# Altium project 23.WatchX_Test2.PrjPcb
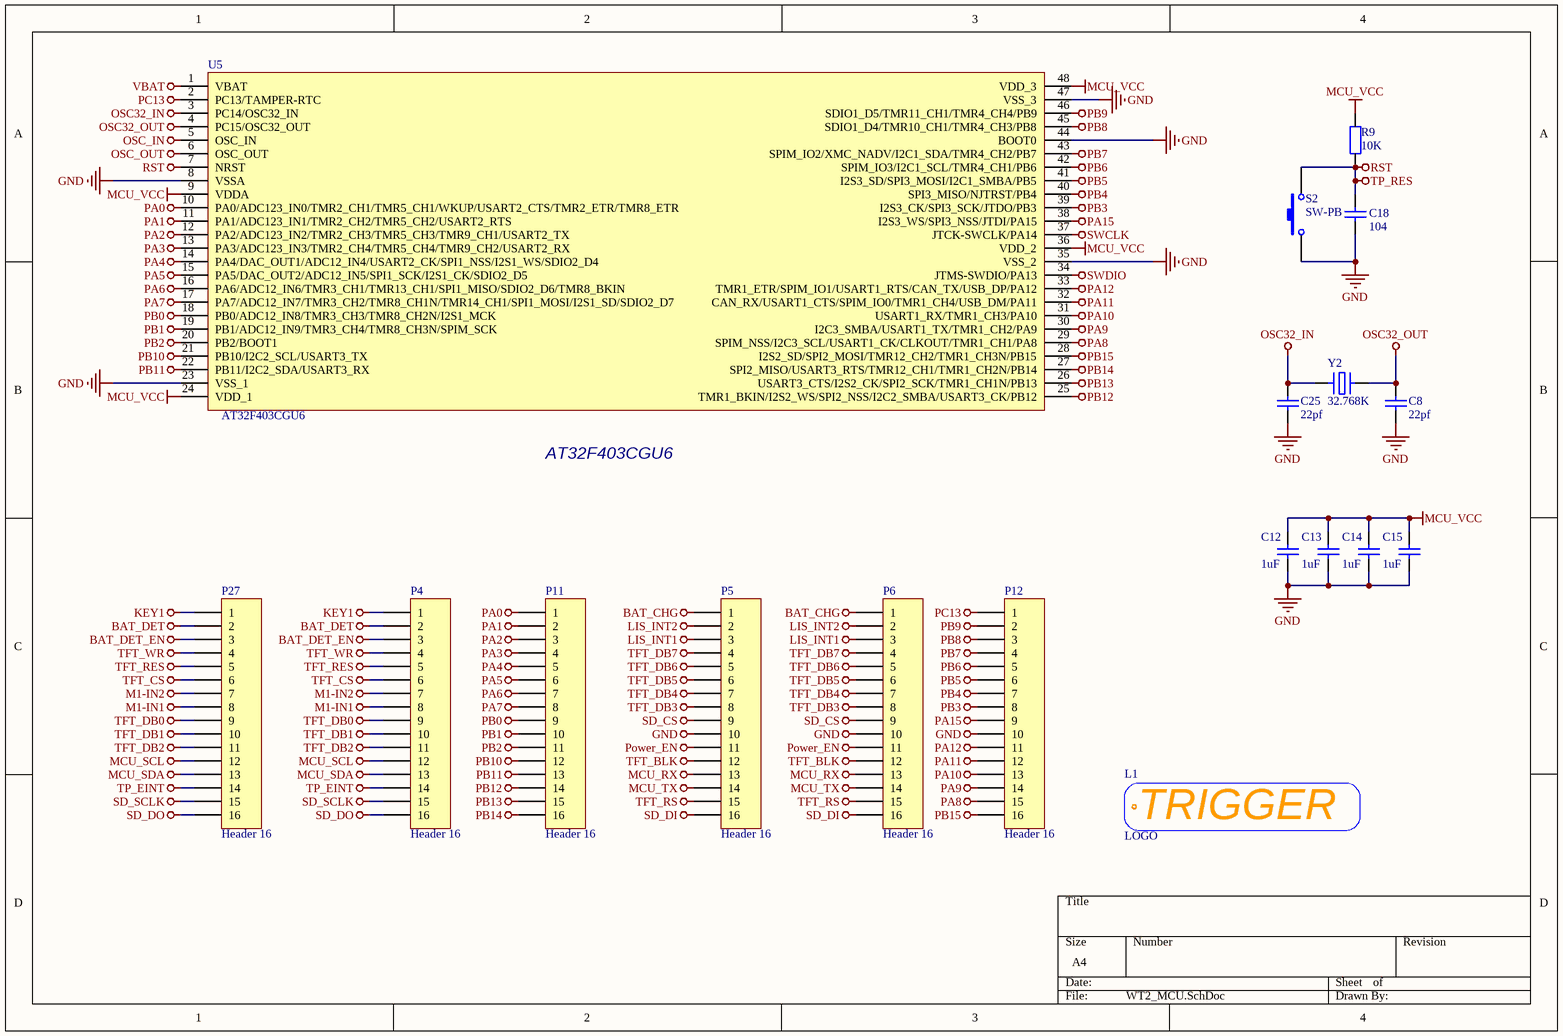
[diagram p0: WT2_MCU.SchDoc]
4 sheets, 98 parts. Net scope: global (net labels, ports and power ports of the same name join across sheets).
Board file: WT2.PcbDoc
Sheets:
  WT2_MCU.SchDoc
  WT2_Power.SchDoc
  WT2_Sensors.SchDoc
  WT2_Screen.SchDoc

## Sheet WT2_MCU.SchDoc
size A4

### Parts
(Parts that share a designator on the sheet are numbered #1, #2 ... from top to bottom, then left to right.)
C8  22pf  [电容_C0603]
C12  1uF  [电容_C0603]
C13  1uF  [电容_C0603]
C14  1uF  [电容_C0603]
C15  1uF  [电容_C0603]
C18  104  [电容_C0603]
C25  22pf  [电容_C0603]
L1  LOGO  [LOGO L BS]
P4  Header 16  [HDR1X16]
P5  Header 16  [HDR1X16]
P6#1  Header 16  [HDR1X16]
P11  Header 16  [HDR1X16]
P12  Header 16  [HDR1X16]
P27  Header 16  [HDR1X16]
R9  10K  [电阻_R0603]
S2  SW-PB  [KEY_6*6mm]
U5  AT32F403CGU6  [AT主控_QFN48(6X6)]
Y2  32.768K  [晶振_3215]

### Nets
BAT_CHG: P5.1 P6#1.1
BAT_DET: P4.2 P27.2
BAT_DET_EN: P4.3 P27.3
GND: C8.2 C12.1 C13.1 C14.1 C15.1 C18.1 C25.2 P5.10 P6#1.10 P12.10 S2.1 U5.0(VSS) U5.8(VSSA) U5.23(VSS_1) U5.35(VSS_2) U5.44(BOOT0) U5.47(VSS_3)
KEY1: P4.1 P27.1
LIS_INT1: P5.3 P6#1.3
LIS_INT2: P5.2 P6#1.2
M1-IN1: P4.8 P27.8
M1-IN2: P4.7 P27.7
MCU_RX: P5.13 P6#1.13
MCU_SCL: P4.12 P27.12
MCU_SDA: P4.13 P27.13
MCU_TX: P5.14 P6#1.14
MCU_VCC: C12.2 C13.2 C14.2 C15.2 R9.2 U5.9(VDDA) U5.24(VDD_1) U5.36(VDD_2) U5.48(VDD_3)
OSC32_IN: C25.1 U5.3(PC14/OSC32_IN) Y2.1
OSC32_OUT: C8.1 U5.4(PC15/OSC32_OUT) Y2.2
OSC_IN: U5.5(OSC_IN)
OSC_OUT: U5.6(OSC_OUT)
PA0: P11.1 U5.10(PA0/ADC123_IN0/TMR2_CH1/TMR5_CH1/WKUP/USART2_CTS/TMR2_ETR/TMR8_ETR)
PA1: P11.2 U5.11(PA1/ADC123_IN1/TMR2_CH2/TMR5_CH2/USART2_RTS)
PA2: P11.3 U5.12(PA2/ADC123_IN2/TMR2_CH3/TMR5_CH3/TMR9_CH1/USART2_TX)
PA3: P11.4 U5.13(PA3/ADC123_IN3/TMR2_CH4/TMR5_CH4/TMR9_CH2/USART2_RX)
PA4: P11.5 U5.14(PA4/DAC_OUT1/ADC12_IN4/USART2_CK/SPI1_NSS/I2S1_WS/SDIO2_D4)
PA5: P11.6 U5.15(PA5/DAC_OUT2/ADC12_IN5/SPI1_SCK/I2S1_CK/SDIO2_D5)
PA6: P11.7 U5.16(PA6/ADC12_IN6/TMR3_CH1/TMR13_CH1/SPI1_MISO/SDIO2_D6/TMR8_BKIN)
PA7: P11.8 U5.17(PA7/ADC12_IN7/TMR3_CH2/TMR8_CH1N/TMR14_CH1/SPI1_MOSI/I2S1_SD/SDIO2_D7)
PA8: P12.15 U5.29(SPIM_NSS/I2C3_SCL/USART1_CK/CLKOUT/TMR1_CH1/PA8)
PA9: P12.14 U5.30(I2C3_SMBA/USART1_TX/TMR1_CH2/PA9)
PA10: P12.13 U5.31(USART1_RX/TMR1_CH3/PA10)
PA11: P12.12 U5.32(CAN_RX/USART1_CTS/SPIM_IO0/TMR1_CH4/USB_DM/PA11)
PA12: P12.11 U5.33(TMR1_ETR/SPIM_IO1/USART1_RTS/CAN_TX/USB_DP/PA12)
PA15: P12.9 U5.38(I2S3_WS/SPI3_NSS/JTDI/PA15)
PB0: P11.9 U5.18(PB0/ADC12_IN8/TMR3_CH3/TMR8_CH2N/I2S1_MCK)
PB1: P11.10 U5.19(PB1/ADC12_IN9/TMR3_CH4/TMR8_CH3N/SPIM_SCK)
PB2: P11.11 U5.20(PB2/BOOT1)
PB3: P12.8 U5.39(I2S3_CK/SPI3_SCK/JTDO/PB3)
PB4: P12.7 U5.40(SPI3_MISO/NJTRST/PB4)
PB5: P12.6 U5.41(I2S3_SD/SPI3_MOSI/I2C1_SMBA/PB5)
PB6: P12.5 U5.42(SPIM_IO3/I2C1_SCL/TMR4_CH1/PB6)
PB7: P12.4 U5.43(SPIM_IO2/XMC_NADV/I2C1_SDA/TMR4_CH2/PB7)
PB8: P12.3 U5.45(SDIO1_D4/TMR10_CH1/TMR4_CH3/PB8)
PB9: P12.2 U5.46(SDIO1_D5/TMR11_CH1/TMR4_CH4/PB9)
PB10: P11.12 U5.21(PB10/I2C2_SCL/USART3_TX)
PB11: P11.13 U5.22(PB11/I2C2_SDA/USART3_RX)
PB12: P11.14 U5.25(TMR1_BKIN/I2S2_WS/SPI2_NSS/I2C2_SMBA/USART3_CK/PB12)
PB13: P11.15 U5.26(USART3_CTS/I2S2_CK/SPI2_SCK/TMR1_CH1N/PB13)
PB14: P11.16 U5.27(SPI2_MISO/USART3_RTS/TMR12_CH1/TMR1_CH2N/PB14)
PB15: P12.16 U5.28(I2S2_SD/SPI2_MOSI/TMR12_CH2/TMR1_CH3N/PB15)
PC13: P12.1 U5.2(PC13/TAMPER-RTC)
Power_EN: P5.11 P6#1.11
RST: C18.2 R9.1 S2.2 U5.7(NRST)  [also labelled TP_RES]
SD_CS: P5.9 P6#1.9
SD_DI: P5.16 P6#1.16
SD_DO: P4.16 P27.16
SD_SCLK: P4.15 P27.15
SWCLK: U5.37(JTCK-SWCLK/PA14)
SWDIO: U5.34(JTMS-SWDIO/PA13)
TFT_BLK: P5.12 P6#1.12
TFT_CS: P4.6 P27.6
TFT_DB0: P4.9 P27.9
TFT_DB1: P4.10 P27.10
TFT_DB2: P4.11 P27.11
TFT_DB3: P5.8 P6#1.8
TFT_DB4: P5.7 P6#1.7
TFT_DB5: P5.6 P6#1.6
TFT_DB6: P5.5 P6#1.5
TFT_DB7: P5.4 P6#1.4
TFT_RES: P4.5 P27.5
TFT_RS: P5.15 P6#1.15
TFT_WR: P4.4 P27.4
TP_EINT: P4.14 P27.14
VBAT: U5.1(VBAT)

### Notes on the sheet
- (near U5) AT32F403CGU6
- (in symbol LOGO_TRIGGER) TRIGGER

### Library data of the parts
C8 C12-C15 C18 C25 = cap: U: 50V; 参数: Cap,0805,X7R,104K,50V,125C,±10%
  C8 C25: C: 22pf
  C12-C15: C: 1uF
  C18: C: 104
L1 = LOGO_TRIGGER
P4 P5 P6#1 P11 P12 P27 = Header 16: Header, 16-Pin; LatestRevisionDate: 17-Jul-2002; LatestRevisionNote: Re-released for DXP Platform.; Publisher: Altium Limited
R9 = Res: P: 1/8W; 参数: Res,0805,0R,±1%,1/8W,100ppm,155C; R: 10K
S2 = SW-PB: 按键
U5 = AT32F403CGU6: _Footprint: QFN48; _Comma: ,; _Name: MCU; _Specification: MCU,AT32F403CGU6,QFN48; _Model: AT32F403CGU6
Y2 = XTAL_A: _Name: CRYSTALS; _Comma: ,; _Specification: CRYSTALS,32.768K,*,10ppm,12pF; _Accuracy: 10ppm; _CL: 12pF; _Footprint: *; _Frequency: 32.768K

## Sheet WT2_Power.SchDoc
size A4
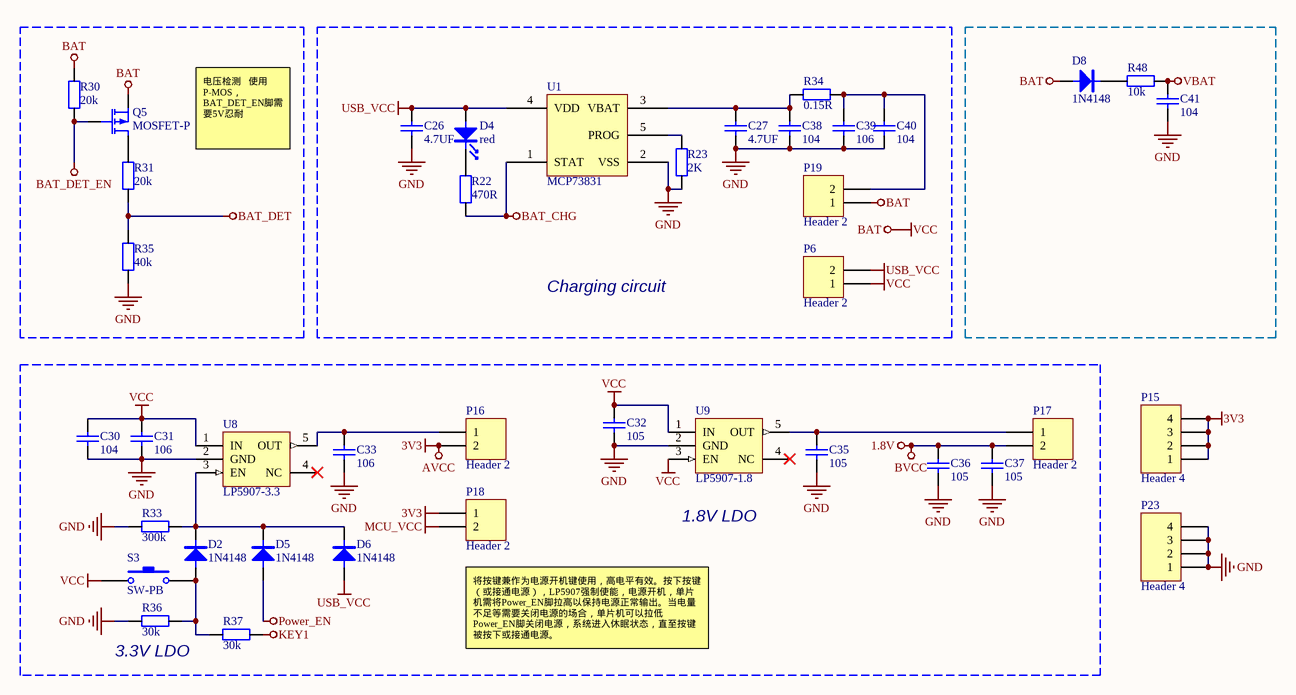
[diagram p1: WT2_Power.SchDoc]

### Parts
(Parts that share a designator on the sheet are numbered #1, #2 ... from top to bottom, then left to right.)
C26  4.7UF  [电容_C0805]
C27  4.7UF  [电容_C0805]
C30  104  [电容_C0603]
C31  106  [电容_C0603]
C32  105  [电容_C0603]
C33  106  [电容_C0603]
C35  105  [电容_C0603]
C36  105  [电容_C0603]
C37  105  [电容_C0603]
C38  104  [电容_C0603]
C39  106  [电容_C0805]
C40  104  [电容_C0603]
C41  104  [电容_C0603]
D2  1N4148  [二极管_SOD-323]
D4  red  [LED_0603]
D5  1N4148  [二极管_SOD-323]
D6  1N4148  [二极管_SOD-323]
D8  1N4148  [二极管_SOD-323]
P6#2  Header 2  [HDR1X2]
P15  Header 4  [HDR1X4]
P16  Header 2  [HDR1X2]
P17  Header 2  [HDR1X2]
P18  Header 2  [HDR1X2]
P19  Header 2  [HDR1X2]
P23  Header 4  [HDR1X4]
Q5  MOSFET-P  [SOT23]
R22  470R  [电阻_R0603]
R23  2K  [电阻_R0603]
R30  20k  [电阻_R0603]
R31  20k  [电阻_R0603]
R33  300k  [电阻_R0603]
R34  0.15R  [电阻_R0603]
R35  40k  [电阻_R0603]
R36  30k  [电阻_R0603]
R37  30k  [电阻_R0603]
R48  10k  [电阻_R0603]
S3  SW-PB  [KEY_6*6mm]
U1  MCP73831  [SOT23-5]
U8  LP5907-3.3  [SOT23-5]
U9  LP5907-1.8  [SOT23-5]

### Blocks framed on the sheet
Charging circuit: C26 C27 C38-C40 D4 P6#2 P19 R22 R23 R34 U1

### Nets
1.8V: C36.2 C37.2 P17.2  [also labelled BVCC]
3V3: P15.1 P15.2 P15.3 P15.4 P16.2 P18.1  [also labelled AVCC]
BAT: C30.2 C31.2 C32.2 D8.A P6#2.1 P19.1 Q5.3(S) R30.2 S3.1 U8.1(IN) U9.1(IN) U9.3(EN)  [also labelled VCC]
BAT_CHG: R22.1 U1.1(STAT)
BAT_DET: R31.1 R35.2
BAT_DET_EN: Q5.1(G) R30.1
GND: C26.1 C27.1 C30.1 C31.1 C32.1 C33.1 C35.1 C36.1 C37.1 C38.2 C39.1 C40.2 C41.2 P23.1 P23.2 P23.3 P23.4 R23.1 R33.2 R35.1 R36.2 U1.2(VSS) U8.2(GND) U9.2(GND)
KEY1: R37.1
MCU_VCC: P18.2
Power_EN: D5.A
USB_VCC: C26.2 D4.A D6.A P6#2.2 U1.4(VDD)
VBAT: C41.1 R48.1
NetC27_2: C27.2 C38.1 R34.2 U1.3(VBAT)
NetC33_2: C33.2 P16.1 U8.5(OUT)
NetC35_2: C35.2 P17.1 U9.5(OUT)
NetC39_2: C39.2 C40.1 P19.2 R34.1
NetD2_A: D2.A R36.1 R37.2 S3.2
NetD2_K: D2.K D5.K D6.K R33.1 U8.3(EN)
NetD4_K: D4.K R22.2
NetD8_K: D8.K R48.2
NetQ5_2: Q5.2(D) R31.2
NetR23_2: R23.2 U1.5(PROG)

Not connected (* = marked no-connect by the designer): U8 4(NC)*; U9 4(NC)*

### Notes on the sheet
- 电压检测   使用P-MOS，BAT_DET_EN脚需要5V忍耐
- (near U9) 1.8V LDO
- (near P18) 将按键兼作为电源开机键使用，高电平有效。按下按键（或接通电源），LP5907强制使能，电源开机，单片机需将Power_EN脚拉高以保持电源正常输出。当电量不足等需要关闭电源的场合，单片机可以拉低Power_EN脚关闭电源，系统进入休眠状态，直至按键被按下或接通电源。
- (near R36) 3.3V LDO

### Library data of the parts
C26 C27 C30-C33 C35-C41 = cap: as C8 on sheet WT2_MCU
  C26 C27: C: 4.7UF
  C30 C38 C40 C41: C: 104
  C31 C33 C39: C: 106
  C32 C35-C37: C: 105
D2 D5 D6 D8 = Diode: _Specification: Diode,1N4148,SOD-323,1A,40V; _Comma: ,; _Footprint: SOD-323; _Voltage: 40V; _Current: 1A; _Name: Diode; _Model: 1N4148
D4 = LED: 参数: LED,0603,Red
P6#2 P16-P19 = Header 2: Header, 2-Pin; LatestRevisionDate: 17-Jul-2002; LatestRevisionNote: Re-released for DXP Platform.; Publisher: Altium Limited
P15 P23 = Header 4: Header, 4-Pin; LatestRevisionDate: 17-Jul-2002; LatestRevisionNote: Re-released for DXP Platform.; Publisher: Altium Limited
Q5 = MOSFET-P: P-Channel MOSFET; Published: 8-Jun-2000; LatestRevisionDate: 17-Jul-2002; LatestRevisionNote: Re-released for DXP Platform.; PackageVersion: 1995/1996; PackageReference: E3; Publisher: Altium Limited; PackageDescription: TO, Flat Index; 3 In-Line, Axial Leads; Body Dia. 4.6mm; Lead Dia. 0.5 mm (max)
R22 R23 R30 R31 R33-R37 R48 = Res: as R9 on sheet WT2_MCU
  R22: R: 470R
  R23: R: 2K
  R30 R31: R: 20k
  R33: R: 300k
  R34: R: 0.15R
  R35: R: 40k
  R36 R37: R: 30k
  R48: R: 10k
S3 = SW-PB: 按键
U1 = MCP73831: 线性充电管理控制器
U8 U9 = LP5907: LDO

## Sheet WT2_Sensors.SchDoc
size A4
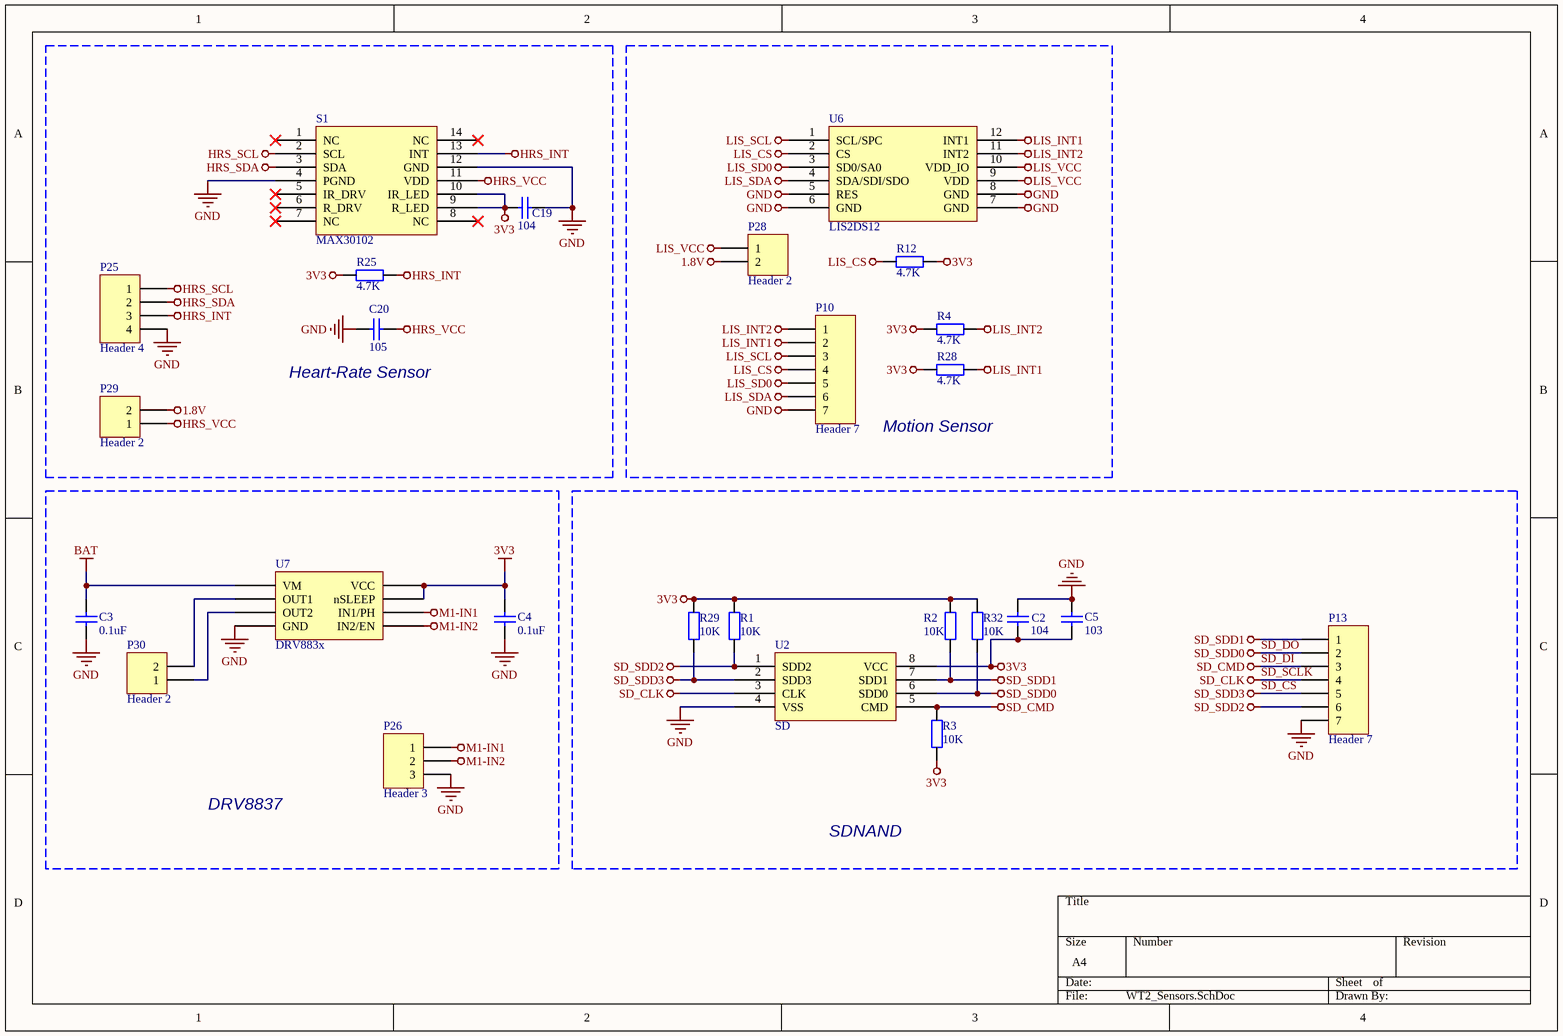
[diagram p2: WT2_Sensors.SchDoc]

### Parts
C2  104  [电容_C0603]
C3  0.1uF  [电容_C0603]
C4  0.1uF  [电容_C0603]
C5  103  [电容_C0603]
C19  104  [电容_C0603]
C20  105  [电容_C0603]
P10  Header 7  [HDR1X7]
P13  Header 7  [HDR1X7]
P25  Header 4  [HDR1X4]
P26  Header 3  [HDR1X3]
P28  Header 2  [HDR1X2]
P29  Header 2  [HDR1X2]
P30  Header 2  [HDR1X2]
R1  10K  [电阻_R0603]
R2  10K  [电阻_R0603]
R3  10K  [电阻_R0603]
R4  4.7K  [电阻_R0603]
R12  4.7K  [电阻_R0603]
R25  4.7K  [电阻_R0603]
R28  4.7K  [电阻_R0603]
R29  10K  [电阻_R0603]
R32  10K  [电阻_R0603]
S1  MAX30102  [MAX30102]
U2  SD  [LGA-8_6*8mm2]
U6  LIS2DS12  [LGA-12_2*2mm]
U7  DRV883x  [WSON-8_2*2]

### Blocks framed on the sheet
Heart-Rate Sensor: C19 C20 P25 P29 R25 S1
Motion Sensor: P10 P28 R4 R12 R28 U6
DRV8837: C3 C4 P26 P30 U7
SDNAND: C2 C5 P13 R1-R3 R29 R32 U2

### Nets
1.8V: P28.2 P29.2
3V3: C2.1 C4.2 C5.1 C19.2 R1.1 R2.1 R3.2 R4.2 R12.1 R25.2 R28.2 R29.1 R32.1 S1.9(R_LED) S1.10(IR_LED) U2.8(VCC) U7.7(nSLEEP) U7.8(VCC)
BAT: C3.1 U7.1(VM)
GND: C2.2 C3.2 C4.1 C5.2 C19.1 C20.2 P10.7 P13.7 P25.4 P26.3 S1.4(PGND) S1.12(GND) U2.4(VSS) U6.5(RES) U6.6(GND) U6.7(GND) U6.8(GND) U7.4(GND)
HRS_INT: P25.3 R25.1 S1.13(INT)
HRS_SCL: P25.1 S1.2(SCL)
HRS_SDA: P25.2 S1.3(SDA)
HRS_VCC: C20.1 P29.1 S1.11(VDD)
LIS_CS: P10.4 R12.2 U6.2(CS)
LIS_INT1: P10.2 R28.1 U6.12(INT1)
LIS_INT2: P10.1 R4.1 U6.11(INT2)
LIS_SCL: P10.3 U6.1(SCL/SPC)
LIS_SD0: P10.5 U6.3(SD0/SA0)
LIS_SDA: P10.6 U6.4(SDA/SDI/SDO)
LIS_VCC: P28.1 U6.9(VDD) U6.10(VDD_IO)
M1-IN1: P26.1 U7.6(IN1/PH)
M1-IN2: P26.2 U7.5(IN2/EN)
SD_CS: P13.5 R29.2 U2.2(SDD3)  [also labelled SD_SDD3]
SD_DI: P13.3 R3.1 U2.5(CMD)  [also labelled SD_CMD]
SD_DO: P13.2 R32.2 U2.6(SDD0)  [also labelled SD_SDD0]
SD_SCLK: P13.4 U2.3(CLK)  [also labelled SD_CLK]
SD_SDD1: P13.1 R2.2 U2.7(SDD1)
SD_SDD2: P13.6 R1.2 U2.1(SDD2)
NetP30_1: P30.1 U7.3(OUT2)
NetP30_2: P30.2 U7.2(OUT1)

Not connected (* = marked no-connect by the designer): S1 1(NC)* 5(IR_DRV)* 6(R_DRV)* 7(NC)* 8(NC)* 14(NC)*

### Library data of the parts
C2-C5 C19 C20 = cap: as C8 on sheet WT2_MCU
  C2 C19: C: 104
  C3 C4: C: 0.1uF
  C5: C: 103
  C20: C: 105
P10 P13 = Header 7: Header, 7-Pin; LatestRevisionDate: 17-Jul-2002; LatestRevisionNote: Re-released for DXP Platform.; Publisher: Altium Limited
P25 = Header 4: Header, 4-Pin; LatestRevisionDate: 17-Jul-2002; LatestRevisionNote: Re-released for DXP Platform.; Publisher: Altium Limited
P26 = Header 3: Header, 3-Pin; LatestRevisionDate: 17-Jul-2002; LatestRevisionNote: Re-released for DXP Platform.; Publisher: Altium Limited
P28-P30 = Header 2: Header, 2-Pin; LatestRevisionDate: 17-Jul-2002; LatestRevisionNote: Re-released for DXP Platform.; Publisher: Altium Limited
R1-R4 R12 R25 R28 R29 R32 = Res: as R9 on sheet WT2_MCU
  R1-R3 R29 R32: R: 10K
  R4 R12 R25 R28: R: 4.7K
S1 = MAX30102: 血氧浓度传感器
U2 = SDNAND
U6 = LIS2DS12: 运动传感器

## Sheet WT2_Screen.SchDoc
size A4
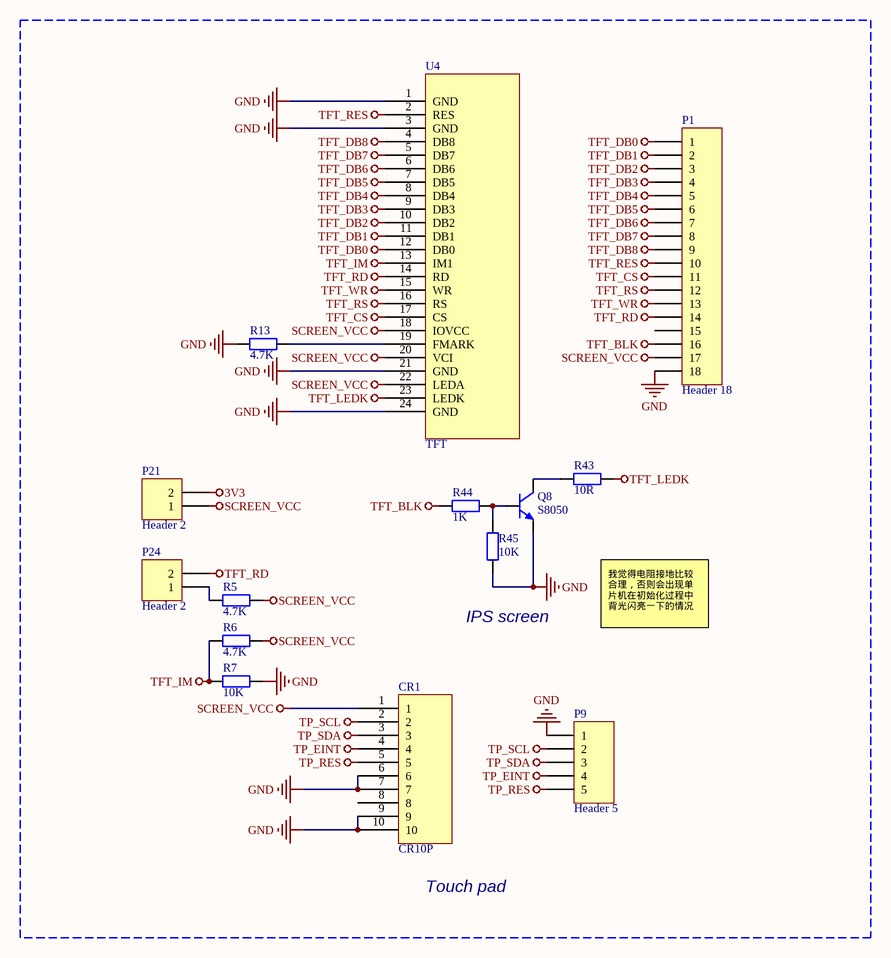
[diagram p3: WT2_Screen.SchDoc]

### Parts
CR1  CR10P  [CONN RCPT 10POS 0.4MM]
P1  Header 18  [HDR1X18]
P9  Header 5  [HDR1X5]
P21  Header 2  [HDR1X2]
P24  Header 2  [HDR1X2]
Q8  S8050  [三极管_SOT-23]
R5  4.7K  [电阻_R0603]
R6  4.7K  [电阻_R0603]
R7  10K  [电阻_R0603]
R13  4.7K  [电阻_R0603]
R43  10R  [电阻_R0603]
R44  1K  [电阻_R0603]
R45  10K  [电阻_R0603]
U4  TFT  [CONN-SMD_DF37NC-24DS-0.4V(51)]

### Nets
3V3: P21.2
GND: CR1.6 CR1.7 CR1.9 CR1.10 P1.18 P9.1 Q8.3(E) R7.1 R13.1 R45.1 U4.1(GND) U4.3(GND) U4.21(GND) U4.24(GND)
SCREEN_VCC: CR1.1 P1.17 P21.1 R5.2 R6.2 U4.18(IOVCC) U4.20(VCI) U4.22(LEDA)
TFT_BLK: P1.16 R44.1
TFT_CS: P1.11 U4.17(CS)
TFT_DB0: P1.1 U4.12(DB0)
TFT_DB1: P1.2 U4.11(DB1)
TFT_DB2: P1.3 U4.10(DB2)
TFT_DB3: P1.4 U4.9(DB3)
TFT_DB4: P1.5 U4.8(DB4)
TFT_DB5: P1.6 U4.7(DB5)
TFT_DB6: P1.7 U4.6(DB6)
TFT_DB7: P1.8 U4.5(DB7)
TFT_DB8: P1.9 U4.4(DB8)
TFT_IM: R6.1 R7.2 U4.13(IM1)
TFT_LEDK: R43.2 U4.23(LEDK)
TFT_RD: P1.14 P24.2 U4.14(RD)
TFT_RES: P1.10 U4.2(RES)
TFT_RS: P1.12 U4.16(RS)
TFT_WR: P1.13 U4.15(WR)
TP_EINT: CR1.4 P9.4
TP_RES: CR1.5 P9.5  [project net RST]
TP_SCL: CR1.2 P9.2
TP_SDA: CR1.3 P9.3
NetP24_1: P24.1 R5.1
NetQ8_1: Q8.1(B) R44.2 R45.2
NetQ8_2: Q8.2(C) R43.1
NetR13_2: R13.2 U4.19(FMARK)

Not connected (* = marked no-connect by the designer): CR1 8; P1 15

### Notes on the sheet
- (near R45) IPS screen
- 我觉得电阻接地比较合理，否则会出现单片机在初始化过程中背光闪亮一下的情况
- Touch pad

### Library data of the parts
CR1 = CONN RCPT 10P: 板对板连接器
P1 = Header 18: Header, 18-Pin; LatestRevisionDate: 17-Jul-2002; LatestRevisionNote: Re-released for DXP Platform.; Publisher: Altium Limited
P9 = Header 5: Header, 5-Pin; LatestRevisionDate: 17-Jul-2002; LatestRevisionNote: Re-released for DXP Platform.; Publisher: Altium Limited
P21 P24 = Header 2: Header, 2-Pin; LatestRevisionDate: 17-Jul-2002; LatestRevisionNote: Re-released for DXP Platform.; Publisher: Altium Limited
Q8 = Triode-NPN: _Comma: ,; _Current: 500mA; _Footprint: SOT-23; _Name: Triode; _Specification: Triode,NPN,S8050,SOT-23,500mA,40V; _Voltage: 40V; _Polarity: NPN; _Model: S8050
R5 R6 R13 = Res: _Accuracy: 1%; _Power: 1/8W; _Footprint: 0805; _Drift: 100ppm; _Comma: ,; _Specification: Res,0805,4.7K,1%,1/8W,100ppm; _Name: Res; _Value: 4.7K
R7 R45 = Res: _Accuracy: 1%; _Power: 1/8W; _Footprint: 0805; _Drift: 100ppm; _Comma: ,; _Specification: Res,0805,10K,1%,1/8W,100ppm; _Name: Res; _Value: 10K
R43 = Res: _Accuracy: 1%; _Power: 1/8W; _Footprint: 0805; _Drift: 100ppm; _Comma: ,; _Specification: Res,0805,10R,1%,1/8W,100ppm; _Name: Res; _Value: 10R
R44 = Res: _Accuracy: 1%; _Power: 1/8W; _Footprint: 0805; _Drift: 100ppm; _Comma: ,; _Specification: Res,0805,1K,1%,1/8W,100ppm; _Name: Res; _Value: 1K
U4 = TFT_IPS_8Bit_1.54_240*240

## Nets that join several sheets
1.8V: WT2_Power (C36.2 C37.2 P17.2), WT2_Sensors (P28.2 P29.2)
3V3: WT2_Power (6 pins), WT2_Sensors (18 pins), WT2_Screen (P21.2)
BAT: WT2_Power (12 pins), WT2_Sensors (C3.1 U7.1)
BAT_CHG: WT2_MCU (P5.1 P6#1.1), WT2_Power (R22.1 U1.1)
BAT_DET: WT2_MCU (P4.2 P27.2), WT2_Power (R31.1 R35.2)
BAT_DET_EN: WT2_MCU (P4.3 P27.3), WT2_Power (Q5.1 R30.1)
GND: WT2_MCU (17 pins), WT2_Power (24 pins), WT2_Sensors (18 pins), WT2_Screen (14 pins)
KEY1: WT2_MCU (P4.1 P27.1), WT2_Power (R37.1)
LIS_INT1: WT2_MCU (P5.3 P6#1.3), WT2_Sensors (P10.2 R28.1 U6.12)
LIS_INT2: WT2_MCU (P5.2 P6#1.2), WT2_Sensors (P10.1 R4.1 U6.11)
M1-IN1: WT2_MCU (P4.8 P27.8), WT2_Sensors (P26.1 U7.6)
M1-IN2: WT2_MCU (P4.7 P27.7), WT2_Sensors (P26.2 U7.5)
MCU_VCC: WT2_MCU (9 pins), WT2_Power (P18.2)
Power_EN: WT2_MCU (P5.11 P6#1.11), WT2_Power (D5.A)
RST: WT2_MCU (C18.2 R9.1 S2.2 U5.7), WT2_Screen (CR1.5 P9.5)
SD_CS: WT2_MCU (P5.9 P6#1.9), WT2_Sensors (P13.5 R29.2 U2.2)
SD_DI: WT2_MCU (P5.16 P6#1.16), WT2_Sensors (P13.3 R3.1 U2.5)
SD_DO: WT2_MCU (P4.16 P27.16), WT2_Sensors (P13.2 R32.2 U2.6)
SD_SCLK: WT2_MCU (P4.15 P27.15), WT2_Sensors (P13.4 U2.3)
TFT_BLK: WT2_MCU (P5.12 P6#1.12), WT2_Screen (P1.16 R44.1)
TFT_CS: WT2_MCU (P4.6 P27.6), WT2_Screen (P1.11 U4.17)
TFT_DB0: WT2_MCU (P4.9 P27.9), WT2_Screen (P1.1 U4.12)
TFT_DB1: WT2_MCU (P4.10 P27.10), WT2_Screen (P1.2 U4.11)
TFT_DB2: WT2_MCU (P4.11 P27.11), WT2_Screen (P1.3 U4.10)
TFT_DB3: WT2_MCU (P5.8 P6#1.8), WT2_Screen (P1.4 U4.9)
TFT_DB4: WT2_MCU (P5.7 P6#1.7), WT2_Screen (P1.5 U4.8)
TFT_DB5: WT2_MCU (P5.6 P6#1.6), WT2_Screen (P1.6 U4.7)
TFT_DB6: WT2_MCU (P5.5 P6#1.5), WT2_Screen (P1.7 U4.6)
TFT_DB7: WT2_MCU (P5.4 P6#1.4), WT2_Screen (P1.8 U4.5)
TFT_RES: WT2_MCU (P4.5 P27.5), WT2_Screen (P1.10 U4.2)
TFT_RS: WT2_MCU (P5.15 P6#1.15), WT2_Screen (P1.12 U4.16)
TFT_WR: WT2_MCU (P4.4 P27.4), WT2_Screen (P1.13 U4.15)
TP_EINT: WT2_MCU (P4.14 P27.14), WT2_Screen (CR1.4 P9.4)
VBAT: WT2_MCU (U5.1), WT2_Power (C41.1 R48.1)